# Altium schematic sheet Sensors.SchDoc: My title
size A3; Organization: University of California; Address1: 475 Portola Plaza; Address2: Los Angeles, CA 90095; DocumentNumber: 20; Revision: R01; SheetNumber: 20; SheetTotal: 35
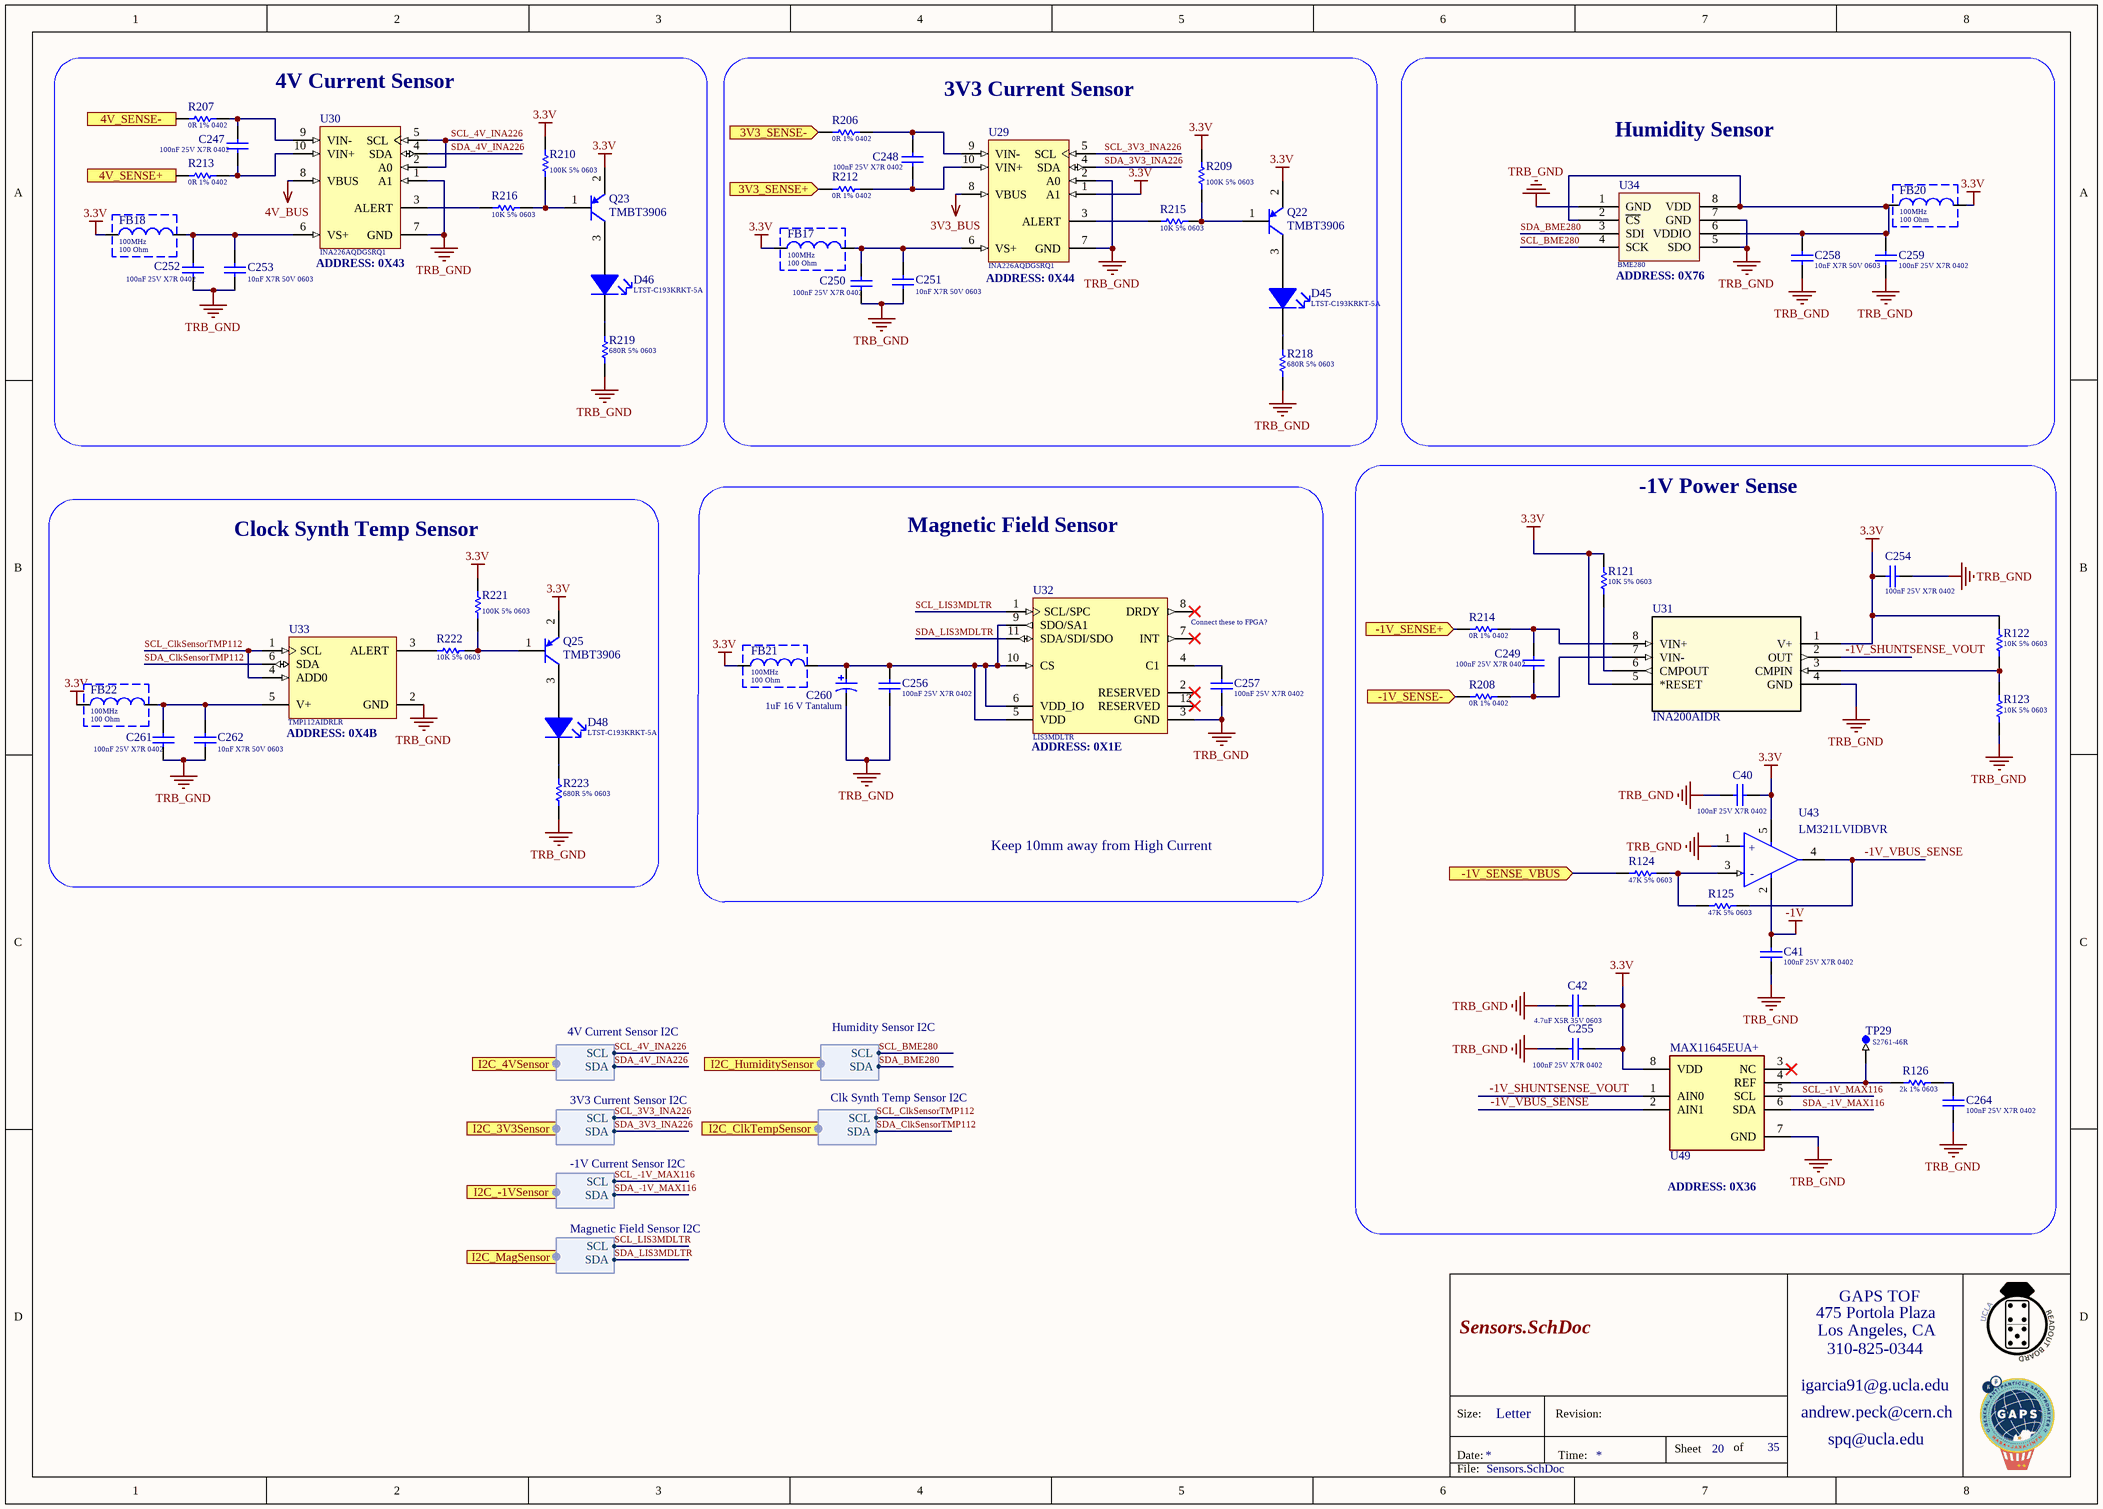
[diagram p0: Sensors.SchDoc]

## Parts
C40  Capacitance: 100nF 25V X7R 0402  [Cap_Taiyo_Yuden_TMK105B7104KV-FR_100nF]  (hidden comment: Cap_Taiyo_Yuden_TMK105B7104KV-FR_100nF)
C41  Capacitance: 100nF 25V X7R 0402  [Cap_Taiyo_Yuden_TMK105B7104KV-FR_100nF]  (hidden comment: Cap_Taiyo_Yuden_TMK105B7104KV-FR_100nF)
C42  Capacitance: 4.7uF X5R 35V 0603  [Cap_Murata_ZRB18AR6YA475ME05L_4.7uF]  (hidden comment: Cap_Murata_ZRB18AR6YA475ME05L_4.7uF)
C247  Capacitance: 100nF 25V X7R 0402  [Cap_Taiyo_Yuden_TMK105B7104KV-FR_100nF]  (hidden comment: Cap_Taiyo_Yuden_TMK105B7104KV-FR_100nF)
C248  Capacitance: 100nF 25V X7R 0402  [Cap_Taiyo_Yuden_TMK105B7104KV-FR_100nF]  (hidden comment: Cap_Taiyo_Yuden_TMK105B7104KV-FR_100nF)
C249  Capacitance: 100nF 25V X7R 0402  [Cap_Taiyo_Yuden_TMK105B7104KV-FR_100nF]  (hidden comment: Cap_Taiyo_Yuden_TMK105B7104KV-FR_100nF)
C250  Capacitance: 100nF 25V X7R 0402  [Cap_Taiyo_Yuden_TMK105B7104KV-FR_100nF]  (hidden comment: Cap_Taiyo_Yuden_TMK105B7104KV-FR_100nF)
C251  Capacitance: 10nF X7R 50V 0603  [Kemet_C0603_0]  (hidden comment: Cap_Kemet_C0603C103J5RACTU_eec)
C252  Capacitance: 100nF 25V X7R 0402  [Cap_Taiyo_Yuden_TMK105B7104KV-FR_100nF]  (hidden comment: Cap_Taiyo_Yuden_TMK105B7104KV-FR_100nF)
C253  Capacitance: 10nF X7R 50V 0603  [Kemet_C0603_0]  (hidden comment: Cap_Kemet_C0603C103J5RACTU_eec)
C254  Capacitance: 100nF 25V X7R 0402  [Cap_Taiyo_Yuden_TMK105B7104KV-FR_100nF]  (hidden comment: Cap_Taiyo_Yuden_TMK105B7104KV-FR_100nF)
C255  Capacitance: 100nF 25V X7R 0402  [Cap_Taiyo_Yuden_TMK105B7104KV-FR_100nF]  (hidden comment: Cap_Taiyo_Yuden_TMK105B7104KV-FR_100nF)
C256  Capacitance: 100nF 25V X7R 0402  [Cap_Taiyo_Yuden_TMK105B7104KV-FR_100nF]  (hidden comment: Cap_Taiyo_Yuden_TMK105B7104KV-FR_100nF)
C257  Capacitance: 100nF 25V X7R 0402  [Cap_Taiyo_Yuden_TMK105B7104KV-FR_100nF]  (hidden comment: Cap_Taiyo_Yuden_TMK105B7104KV-FR_100nF)
C258  Capacitance: 10nF X7R 50V 0603  [Kemet_C0603_0]  (hidden comment: Cap_Kemet_C0603C103J5RACTU_eec)
C259  Capacitance: 100nF 25V X7R 0402  [Cap_Taiyo_Yuden_TMK105B7104KV-FR_100nF]  (hidden comment: Cap_Taiyo_Yuden_TMK105B7104KV-FR_100nF)
C260  1uF 16 V Tantalum  [KEMT-T491A105K016AT_L]
C261  Capacitance: 100nF 25V X7R 0402  [Cap_Taiyo_Yuden_TMK105B7104KV-FR_100nF]  (hidden comment: Cap_Taiyo_Yuden_TMK105B7104KV-FR_100nF)
C262  Capacitance: 10nF X7R 50V 0603  [Kemet_C0603_0]  (hidden comment: Cap_Kemet_C0603C103J5RACTU_eec)
C264  Capacitance: 100nF 25V X7R 0402  [Cap_Taiyo_Yuden_TMK105B7104KV-FR_100nF]  (hidden comment: Cap_Taiyo_Yuden_TMK105B7104KV-FR_100nF)
D45  LTST-C193KRKT-5A  [Led_Lite-On_LTST-C193KGKT-5A_Red]
D46  LTST-C193KRKT-5A  [Led_Lite-On_LTST-C193KGKT-5A_Red]
D48  LTST-C193KRKT-5A  [Led_Lite-On_LTST-C193KGKT-5A_Red]
FB17  Measuring Frequency: 100MHz  Impedance: 100 Ohm  [FB_Wurth_Electronics_742792731_100Ohms]  (hidden comment: 742792731)
FB18  Measuring Frequency: 100MHz  Impedance: 100 Ohm  [FB_Wurth_Electronics_742792731_100Ohms]  (hidden comment: 742792731)
FB20  Measuring Frequency: 100MHz  Impedance: 100 Ohm  [FB_Wurth_Electronics_742792731_100Ohms]  (hidden comment: 742792731)
FB21  Measuring Frequency: 100MHz  Impedance: 100 Ohm  [FB_Wurth_Electronics_742792731_100Ohms]  (hidden comment: 742792731)
FB22  Measuring Frequency: 100MHz  Impedance: 100 Ohm  [FB_Wurth_Electronics_742792731_100Ohms]  (hidden comment: 742792731)
Q22  Series: TMBT3906  [BJT_PNP_Toshiba_TMBT3906]  (hidden comment: BJT_PNP_Toshiba_TMBT3906)
Q23  Series: TMBT3906  [BJT_PNP_Toshiba_TMBT3906]  (hidden comment: BJT_PNP_Toshiba_TMBT3906)
Q25  Series: TMBT3906  [BJT_PNP_Toshiba_TMBT3906]  (hidden comment: BJT_PNP_Toshiba_TMBT3906)
R121  10K 5% 0603  [RESC0603(1608)_L]
R122  10K 5% 0603  [RESC0603(1608)_L]
R123  10K 5% 0603  [RESC0603(1608)_L]
R124  47K 5% 0603  [RESC0603(1608)_L]
R125  47K 5% 0603  [RESC0603(1608)_L]
R126  2k 1% 0603  [RESC1608X55X30ML15T15]
R206  Resistance: 0R 1% 0402  [Res_Vishay_CRCW04020000Z0EDC_0_Ohm]  (hidden comment: Res_Vishay_CRCW04020000Z0EDC_0_Ohm)
R207  Resistance: 0R 1% 0402  [Res_Vishay_CRCW04020000Z0EDC_0_Ohm]  (hidden comment: Res_Vishay_CRCW04020000Z0EDC_0_Ohm)
R208  Resistance: 0R 1% 0402  [Res_Vishay_CRCW04020000Z0EDC_0_Ohm]  (hidden comment: Res_Vishay_CRCW04020000Z0EDC_0_Ohm)
R209  100K 5% 0603  [RESC0603(1608)_N]
R210  100K 5% 0603  [RESC0603(1608)_N]
R212  Resistance: 0R 1% 0402  [Res_Vishay_CRCW04020000Z0EDC_0_Ohm]  (hidden comment: Res_Vishay_CRCW04020000Z0EDC_0_Ohm)
R213  Resistance: 0R 1% 0402  [Res_Vishay_CRCW04020000Z0EDC_0_Ohm]  (hidden comment: Res_Vishay_CRCW04020000Z0EDC_0_Ohm)
R214  Resistance: 0R 1% 0402  [Res_Vishay_CRCW04020000Z0EDC_0_Ohm]  (hidden comment: Res_Vishay_CRCW04020000Z0EDC_0_Ohm)
R215  10K 5% 0603  [RESC0603(1608)_L]
R216  10K 5% 0603  [RESC0603(1608)_L]
R218  680R 5% 0603  [RESC0603(1608)_L]
R219  680R 5% 0603  [RESC0603(1608)_L]
R221  100K 5% 0603  [RESC0603(1608)_N]
R222  10K 5% 0603  [RESC0603(1608)_L]
R223  680R 5% 0603  [RESC0603(1608)_L]
TP29  Series: S2761-46R  [TP_Harwin_S2761_46R]  (hidden comment: TP_Harwin_S2761_46R)
U29  INA226AQDGSRQ1  [INA226AQDGSRQ1]
U30  INA226AQDGSRQ1  [INA226AQDGSRQ1]
U31  INA200AIDR  [D8]
U32  LIS3MDLTR  [LIS3MDLTR]
U33  TMP112AIDRLR  [TMP112AIDRLR]
U34  BME280  [BME280]
U43  LM321LVIDBVR  [Texas_Instruments_LM321LVIDBVR_MFG]
U49  MAX11645EUA+  [Maxim_Electronics_8-uMAX_0]

## Blocks framed on the sheet
4V Current Sensor: C247 C252 C253 D46 FB18 Q23 R207 R210 R213 R216 R219 U30
3V3 Current Sensor: C248 C250 C251 D45 FB17 Q22 R206 R209 R212 R215 R218 U29
Humidity Sensor: C258 C259 FB20 U34
Clock Synth Temp Sensor: C261 C262 D48 FB22 Q25 R221-R223 U33
-1V Power Sense: C40-C42 C249 C254 C255 C264 R121-R126 R208 R214 TP29 U31 U43 U49

## Ports
3V3_SENSE+ (in), 3V3_SENSE- (in), 4V_SENSE+ (in), 4V_SENSE- (in), -1V_SENSE+ (in), -1V_SENSE- (in), -1V_SENSE_VBUS (in), I2C_3V3Sensor (harness 3V3 Current Sensor I2C), I2C_4VSensor (harness 4V Current Sensor I2C), I2C_-1VSensor (harness -1V Current Sensor I2C), I2C_ClkTempSensor (harness Clk Synth Temp Sensor I2C), I2C_HumiditySensor (harness Humidity Sensor I2C), I2C_MagSensor (harness Magnetic Field Sensor I2C)

## Harnesses
4V Current Sensor I2C: SCL, SDA
3V3 Current Sensor I2C: SCL, SDA
-1V Current Sensor I2C: SCL, SDA
Magnetic Field Sensor I2C: SCL, SDA
Humidity Sensor I2C: SCL, SDA
Clk Synth Temp Sensor I2C: SCL, SDA

## Nets
3.3V: C40.2 C42.1 C254.2 C255.2 FB17.1 FB18.1 FB20.2 FB21.1 FB22.1 Q22.2(E) Q23.2(E) Q25.2(E) R121.1 R122.1 R209.2 R210.2 R221.2 U29.1(A1) U31.1(V+) U31.5(*RESET) U43.5(V+) U49.8(VDD)
3V3_BUS: U29.8(VBUS)
4V_BUS: U30.8(VBUS)
-1V: C41.2 U43.2(V-)
TRB_GND: C40.1 C41.1 C42.2 C250.1 C251.2 C252.1 C253.2 C254.1 C255.1 C256.2 C257.2 C258.2 C259.2 C260.2 C261.1 C262.2 C264.1 R123.2 R218.1 R219.1 R223.1 U29.2(A0) U29.7(GND) U30.1(A1) U30.7(GND) U31.4(GND) U32.3(GND) U33.2(GND) U34.1(GND) U34.5(SDO) U34.7(GND) U43.1(IN+) U49.7(GND)
3V3_SENSE+: R212.2 ; port 3V3_SENSE+
3V3_SENSE-: R206.2 ; port 3V3_SENSE-
4V_SENSE+: R213.2 ; port 4V_SENSE+
4V_SENSE-: R207.2 ; port 4V_SENSE-
-1V_SENSE+: R214.2 ; port -1V_SENSE+
-1V_SENSE-: R208.2 ; port -1V_SENSE-
-1V_SENSE_VBUS: R124.2 ; port -1V_SENSE_VBUS
-1V_SHUNTSENSE_VOUT: U31.2(OUT) U49.1(AIN0)
-1V_VBUS_SENSE: R125.1 U43.4(OUT) U49.2(AIN1)
SCL_3V3_INA226: U29.5(SCL) ; port I2C_3V3Sensor.SCL
SCL_4V_INA226: U30.2(A0) U30.5(SCL) ; port I2C_4VSensor.SCL
SCL_-1V_MAX116: U49.5(SCL) ; port I2C_-1VSensor.SCL
SCL_BME280: U34.4(SCK) ; port I2C_HumiditySensor.SCL
SCL_ClkSensorTMP112: U33.1(SCL) U33.4(ADD0) ; port I2C_ClkTempSensor.SCL
SCL_LIS3MDLTR: U32.1(SCL/SPC) ; port I2C_MagSensor.SCL
SDA_3V3_INA226: U29.4(SDA) ; port I2C_3V3Sensor.SDA
SDA_4V_INA226: U30.4(SDA) ; port I2C_4VSensor.SDA
SDA_-1V_MAX116: U49.6(SDA) ; port I2C_-1VSensor.SDA
SDA_BME280: U34.3(SDI) ; port I2C_HumiditySensor.SDA
SDA_ClkSensorTMP112: U33.6(SDA) ; port I2C_ClkTempSensor.SDA
SDA_LIS3MDLTR: U32.11(SDA/SDI/SDO) ; port I2C_MagSensor.SDA
NetC247_1: C247.1 R213.1 U30.10(VIN+)
NetC247_2: C247.2 R207.1 U30.9(VIN-)
NetC248_1: C248.1 R212.1 U29.10(VIN+)
NetC248_2: C248.2 R206.1 U29.9(VIN-)
NetC249_1: C249.1 R208.1 U31.7(VIN-)
NetC249_2: C249.2 R214.1 U31.8(VIN+)
NetC250_2: C250.2 C251.1 FB17.2 U29.6(VS+)
NetC252_2: C252.2 C253.1 FB18.2 U30.6(VS+)
NetC256_1: C256.1 C260.1 FB21.2 U32.5(VDD) U32.6(VDD_IO) U32.9(SDO/SA1) U32.10(CS)
NetC257_1: C257.1 U32.4(C1)
NetC258_1: C258.1 C259.1 FB20.1 U34.2(~{CS}) U34.6(VDDIO) U34.8(VDD)
NetC261_2: C261.2 C262.1 FB22.2 U33.5(V+)
NetC264_2: C264.2 R126.2
NetD45_1: D45.1(K) R218.2
NetD45_2: D45.2(A) Q22.3(C)
NetD46_1: D46.1(K) R219.2
NetD46_2: D46.2(A) Q23.3(C)
NetD48_1: D48.1(K) R223.2
NetD48_2: D48.2(A) Q25.3(C)
NetQ22_1: Q22.1(B) R209.1 R215.1
NetQ23_1: Q23.1(B) R210.1 R216.1
NetQ25_1: Q25.1(B) R221.1 R222.1
NetR121_2: R121.2 U31.6(CMPOUT)
NetR122_2: R122.2 R123.1 U31.3(CMPIN)
NetR124_1: R124.1 R125.2 U43.3(IN-)
NetR126_1: R126.1 TP29.1 U49.4(REF)
NetR215_2: R215.2 U29.3(ALERT)
NetR216_2: R216.2 U30.3(ALERT)
NetR222_2: R222.2 U33.3(ALERT)

Not connected (* = marked no-connect by the designer): U32 2(RESERVED)* 7(INT)* 8(DRDY)* 12(RESERVED)*; U49 3(NC)*

## Notes on the sheet
- (near U30) ADDRESS: 0X43
- (near U29) ADDRESS: 0X44
- (near U34) ADDRESS: 0X76
- Magnetic Field Sensor
- (near U32) Connect these to FPGA?
- (near U33) ADDRESS: 0X4B
- (near U32) ADDRESS: 0X1E
- Keep 10mm away from High Current
- (near U49) ADDRESS: 0X36
- 475 Portola Plaza
- GAPS TOF
- igarcia91@g.ucla.edu
- Los Angeles, CA
- 310-825-0344
- Size:
- Date:
- Letter
- Revision:
- Time:
- Sheet
- of
- andrew.peck@cern.ch
- spq@ucla.edu
- File:
- (in symbol LM321LVIDBVR) +; -

## Library data of the parts
C40 C41 C247-C250 C252 C254-C257 C259 C261 C264 = Cap_Taiyo_Yuden_TMK105B7104KV-FR_100nF: CAP CER 100nF 25V X7R 0402; Supplier 1: Mouser; Supplier Part Number 1: 963-TMK105B7104KV-FR
C42 = Cap_Murata_ZRB18AR6YA475ME05L_4.7uF: CAP CER 4.7uF 35V X5R 0603; Supplier 1: Mouser; Supplier Part Number 1: 81-ZRB18AR6YA475ME5L
C251 C253 C258 C262 = Cap_Kemet_C0603C103J5RACTU_eec: CAP CER 10nF 50V X7R 0603; Manufacturer: Kemet; Mfg Package Ident: C0603; Part Number: C0603C103J5RACTU; helpURL: https://upverter.com/upn/revision/8a8d0c297e33ac74/; ComponentLink2Description: Datasheet; Temperature: -55°C to +125°C; Package: C0603; Supplier 2: Mouser; Price: 0.0184203126773; Supplier 1: Digi-Key; ComponentLink1URL: https://upverter.com/upn/revision/8a8d0c297e33ac74/; Supplier Part Number 2: 80-C0603C103J5R; Supplier Part Number 1: 399-1092-1-ND; Value: 10nF; ComponentLink1Description: Upverter; ComponentLink2URL: https://content.kemet.com/datasheets/KEM_C1002_X7R_SMD.pdf; RoHS: TRUE; Mouser Part Number: 80-C0603C103J5R; Temperature Range High: +125°C; Digikey Description: CAP CER 10000PF 50V X7R 0603; Digikey Part Number: 399-1092-1-ND; Lead Free: yes; Temperature Range Low: -55°C; Voltage: 50V
C260 = CMP-2000-07186-1: Tantalun Capacitor, 1 uF, +/- 10%, 16 V, -55 to 125 degC, 2-Pin SMD, RoHS, Tape and Reel; Manufacturer: Kemet; Manufacturer Size Code: A; Type: Molded; Online Catalog: T491Series; Lifetime @ Temp.: 2000Hrs@85°C; Catalog Drawings: T49x,T5xxSeries_A-side1T49x,T5xxSeries_A,B-side2T49x,T5xxSeries_A,SBottom; Other Names: 399-3678-6; EDA / CAD Models: DownloadfromAcceleratedDesigns; Capacitance: 1.0µF; ESR (Equivalent Series Resistance): 10Ohm; Voltage - Rated: 16V; Product Training Modules: CapacitorBasics-TypicalUsesforCapacitorsDeratingGuidelinesforSurfaceMountTantalumCapacitors; Category: Capacitors; Lead Spacing: -; Package Description: 2-Pin Surface Mounted Device, Body 3.2 x 1.6 mm; Height - Seated (Max): 0.071"(1.80mm); Mounting Technology: SurfaceMount; Mounting Type: SurfaceMount; Standard Package: 1; Tolerance: ±10%; Datasheet Version: 06/2016; Manufacturer URL: http://www.kemet.com/; Packaging: Digi-Reel®; Family: TantalumCapacitors; Series: T491; Size / Dimension: 0.126"Lx0.063"W(3.20mmx1.60mm); Package / Case: 1206(3216Metric); Datasheet URL: http://capacitoredge.kemet.com/capedge2/DataSheet/Datasheet-T491A105K016AT.pdf?pn=T491A105K016AT; Operating Temperature: -55°C~125°C; Package Reference: 1206; Features: GeneralPurpose
D45 D46 D48 = Led_Lite-On_LTST-C193KGKT-5A_Red: Standard LEDs - SMD Red 470nm 28mcd 20mA; Supplier 1: Mouser; Supplier Part Number 1: 859-LTSTC193KRKT5A; Series: LTST-C193KRKT-5A
FB17 FB18 FB20-FB22 = FB_Wurth_Electronics_742792731_100Ohms: FB SMD 100 OHM 25% 1.2A 0402; DC Resistance: 90mOhm; Supplier 1: Mouser; Supplier Part Number 1: 710-742792731
Q22 Q23 Q25 = BJT_PNP_Toshiba_TMBT3906: Bipolar Transistors - BJT Transistor for Low Freq. Amplification; Manufacturer Part Number 1: TMBT3906,LM; Supplier 1: Mouser; Supplier Part Number 1: 757-TMBT3906LM; Manufacturer: Toshiba
R121-R123 R215 R216 R222 = CMP-1012-00098-1: 10K 0.1W 5% 0603 (1608 Metric)  SMD; Case-EIA: 0603; Value: 10000.00 Ohm; Case-Metric: 1608; Technology: SMT; Tolerance: 5 %; Power: 0.1 W
R124 R125 = CMP-1012-00114-1: 47K 0.1W 5% 0603 (1608 Metric)  SMD; Case-EIA: 0603; Value: 47000.00 Ohm; Case-Metric: 1608; Tolerance: 5 %; Power: 0.1 W; Technology: SMT
R126 = CMP-2000-00317-1: ERJ-3EKF2001V RES SMD 2K OHM 1% 1/10W 0603; Manufacturer: Panasonic; Part Number: ERJ-3EKF2001V
R206-R208 R212-R214 = Res_Vishay_CRCW04020000Z0EDC_0_Ohm: 0R 0.062W 1% 0402 (1005 Metric)  SMD; Supplier 1: Mouser; Supplier Part Number 1: 71-CRCW04020000Z0EDC
R209 R210 R221 = CMP-1012-00122-1: 100K 0.1W 5% 0603 (1608 Metric)  SMD; Case-EIA: 0603; Value: 100000.00 Ohm; Case-Metric: 1608; Tolerance: 5 %; Power: 0.1 W; Technology: SMT
R218 R219 R223 = CMP-1012-00070-1: 680R 0.1W 5% 0603 (1608 Metric)  SMD; Case-EIA: 0603; Value: 680.00 Ohm; Case-Metric: 1608; Tolerance: 5 %; Technology: SMT; Power: 0.1 W
TP29 = TP_Harwin_S2761_46R: Circuit Board Hardware - PCB SMT Mini Test Terminal, Reel; Supplier 1: Newark; Supplier Part Number 1: 76Y5391
U29 U30 = INA226AQDGSRQ1: Current & Power Monitors & Regulators Automotive, 36-V, Ultra-High Accuracy, Low-/High-Side, I2C Out Current/Power Monitor w/ Alert 10-VSSOP -40 to 125; Supplier 1: Mouser; Supplier Part Number 1: 595-INA226AQDGSRQ1
U31 = INA200AIDR: High-Side Measurement Current-Shunt Monitor with Comparator and Reference; Manufacturer: Texas Instruments; GENERIC_PART_NUMBER: INA200; INDUSTRY_STD_PKG_TYPE: SOIC; FAMILY_NAME: CURRENT SHUNT MONITOR; PIN_COUNT: 8; PACKAGE_DESIGNATOR: D; Datasheet_URL: http://www.ti.com/lit/gpn/INA200; Vendor: Texas Instruments; Manufacturer_Part_Number: INA200AIDR; Copyright: Copyright (C) 2018 Accelerated Designs. All rights reserved; RefDes: RefDes; Type: DEV
U32 = LIS3MDLTR: Board Mount Hall Effect / Magnetic Sensors Ultra Lo-Pwr Hi Perf 3-Axis 1.9-3.6V; Supplier 1: Mouser; Supplier Part Number 1: 511-LIS3MDLTR
U33 = TMP112AIDRLR: Board Mount Temperature Sensors Hi-Prec Lo-Pwr Dig Temp Sensor; Supplier 1: Mouser; Supplier Part Number 1: 595-TMP112AIDRLR
U34 = BME280: Board Mount Humidity Sensors; Supplier 1: Mouser; Supplier Part Number 1: 262-BME280
U43 = LM321LVIDBVR: IC OPAMP GP 1 CIRCUIT SOT23-5; Part Number: LM321LVIDBVR; Supplier 1: Mouser; Supplier Part Number 1: 595-LM321LVIDBVR
U49 = MAX11645EUA+: Part Number: MAX11645EUA+; ComponentLink1Description: helpURL; ComponentLink1URL: https://www.maximintegrated.com/en/products/analog/data-converters/analog-to-digital-converters/MAX11645.html; Supplier 1: Mouser; Supplier Part Number 1: https://www.mouser.com/ProductDetail/Maxim-Integrated/MAX11645EUA%2B?qs=Bakm8ERcljromEtBj8vNxg%3D%3D